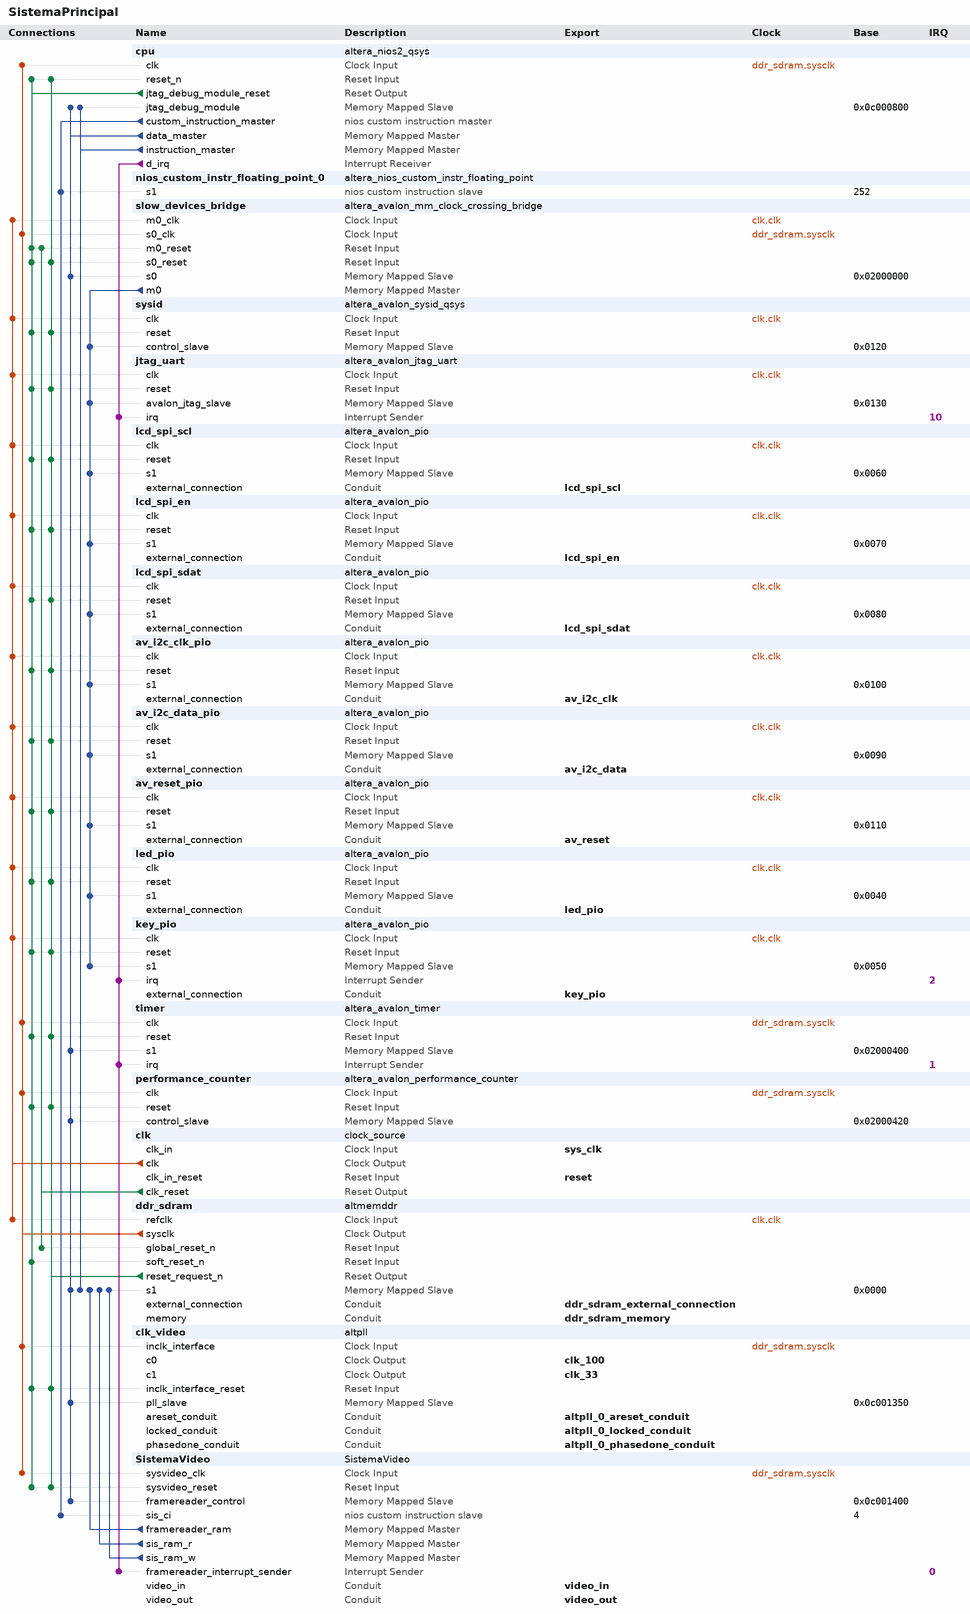
[diagram p0: system contents]
# Platform Designer (Qsys) system SistemaPrincipal, Cyclone III EP3C25F324C6
# Parameters at their usual value, and those the tool derives, are not listed.
package require -exact qsys 12.1
create_system SistemaPrincipal
set_project_property DEVICE_FAMILY {Cyclone III}
set_project_property DEVICE EP3C25F324C6

add_instance cpu altera_nios2_qsys 12.1
set_instance_parameter_value cpu manuallyAssignCpuID false
set_instance_parameter_value cpu resetSlave ddr_sdram.s1
set_instance_parameter_value cpu exceptionSlave ddr_sdram.s1
set_instance_parameter_value cpu breakSlave cpu.jtag_debug_module
set_instance_parameter_value cpu impl Fast
set_instance_parameter_value cpu icache_size 4096
set_instance_parameter_value cpu dcache_size 1024

add_instance nios_custom_instr_floating_point_0 altera_nios_custom_instr_floating_point 12.1
set_instance_parameter_value nios_custom_instr_floating_point_0 useDivider 0

add_instance slow_devices_bridge altera_avalon_mm_clock_crossing_bridge 12.1
set_instance_parameter_value slow_devices_bridge DATA_WIDTH 32
set_instance_parameter_value slow_devices_bridge ADDRESS_WIDTH 10
set_instance_parameter_value slow_devices_bridge MAX_BURST_SIZE 1
set_instance_parameter_value slow_devices_bridge COMMAND_FIFO_DEPTH 16
set_instance_parameter_value slow_devices_bridge RESPONSE_FIFO_DEPTH 64
set_instance_parameter_value slow_devices_bridge MASTER_SYNC_DEPTH 3
set_instance_parameter_value slow_devices_bridge SLAVE_SYNC_DEPTH 3

add_instance sysid altera_avalon_sysid_qsys 12.1
set_instance_parameter_value sysid id 0

add_instance jtag_uart altera_avalon_jtag_uart 12.1
set_instance_parameter_value jtag_uart readBufferDepth 32
set_instance_parameter_value jtag_uart readIRQThreshold 4
set_instance_parameter_value jtag_uart simInteractiveOptions NO_INTERACTIVE_WINDOWS
set_instance_parameter_value jtag_uart writeBufferDepth 32
set_instance_parameter_value jtag_uart writeIRQThreshold 4

add_instance lcd_spi_scl altera_avalon_pio 12.1
set_instance_parameter_value lcd_spi_scl direction Output
set_instance_parameter_value lcd_spi_scl width 1

add_instance lcd_spi_en altera_avalon_pio 12.1
set_instance_parameter_value lcd_spi_en direction Output
set_instance_parameter_value lcd_spi_en width 1

add_instance lcd_spi_sdat altera_avalon_pio 12.1
set_instance_parameter_value lcd_spi_sdat direction Bidir
set_instance_parameter_value lcd_spi_sdat simDoTestBenchWiring true
set_instance_parameter_value lcd_spi_sdat width 1

add_instance av_i2c_clk_pio altera_avalon_pio 12.1
set_instance_parameter_value av_i2c_clk_pio direction Output
set_instance_parameter_value av_i2c_clk_pio width 1

add_instance av_i2c_data_pio altera_avalon_pio 12.1
set_instance_parameter_value av_i2c_data_pio direction Bidir
set_instance_parameter_value av_i2c_data_pio simDoTestBenchWiring true
set_instance_parameter_value av_i2c_data_pio width 1

add_instance av_reset_pio altera_avalon_pio 12.1
set_instance_parameter_value av_reset_pio direction Output
set_instance_parameter_value av_reset_pio width 1

add_instance led_pio altera_avalon_pio 12.1
set_instance_parameter_value led_pio direction Output
set_instance_parameter_value led_pio width 8

add_instance key_pio altera_avalon_pio 12.1
set_instance_parameter_value key_pio captureEdge true
set_instance_parameter_value key_pio direction Input
set_instance_parameter_value key_pio generateIRQ true
set_instance_parameter_value key_pio irqType EDGE
set_instance_parameter_value key_pio width 8

add_instance timer altera_avalon_timer 12.1
set_instance_parameter_value timer period 10
set_instance_parameter_value timer periodUnits USEC
set_instance_parameter_value timer timerPreset FULL_FEATURED

add_instance performance_counter altera_avalon_performance_counter 12.1
set_instance_parameter_value performance_counter numberOfSections 1

add_instance clk clock_source 12.1
set_instance_parameter_value clk clockFrequency 50000000

add_instance ddr_sdram altmemddr 12.1
set_instance_parameter_value ddr_sdram pipeline_commands false
set_instance_parameter_value ddr_sdram debug_en false
set_instance_parameter_value ddr_sdram export_debug_port false
set_instance_parameter_value ddr_sdram use_generated_memory_model true
set_instance_parameter_value ddr_sdram dedicated_memory_clk_phase_label {Dedicated memory clock phase:}
set_instance_parameter_value ddr_sdram mem_if_clk_mhz 150.0
set_instance_parameter_value ddr_sdram quartus_project_exists false
set_instance_parameter_value ddr_sdram local_if_drate Full
set_instance_parameter_value ddr_sdram enable_v72_rsu false
set_instance_parameter_value ddr_sdram local_if_clk_mhz_label 150,0
set_instance_parameter_value ddr_sdram new_variant true
set_instance_parameter_value ddr_sdram mem_if_memtype {DDR SDRAM}
set_instance_parameter_value ddr_sdram pll_ref_clk_mhz 50.0
set_instance_parameter_value ddr_sdram mem_if_clk_ps_label {(6667 ps)}
set_instance_parameter_value ddr_sdram family {Cyclone III}
set_instance_parameter_value ddr_sdram project_family {Cyclone III}
set_instance_parameter_value ddr_sdram speed_grade 6
set_instance_parameter_value ddr_sdram dedicated_memory_clk_phase 0
set_instance_parameter_value ddr_sdram pll_ref_clk_ps_label {(20000 ps)}
set_instance_parameter_value ddr_sdram avalon_burst_length 1
set_instance_parameter_value ddr_sdram mem_if_clk_pair_count 1
set_instance_parameter_value ddr_sdram mem_if_cs_per_dimm 1
set_instance_parameter_value ddr_sdram pre_latency_label {Fix read latency at:}
set_instance_parameter_value ddr_sdram dedicated_memory_clk_en false
set_instance_parameter_value ddr_sdram mirror_addressing 0
set_instance_parameter_value ddr_sdram mem_if_bankaddr_width 2
set_instance_parameter_value ddr_sdram register_control_word_9 0000
set_instance_parameter_value ddr_sdram mem_if_rowaddr_width 13
set_instance_parameter_value ddr_sdram mem_dyn_deskew_en false
set_instance_parameter_value ddr_sdram post_latency_label {cycles (0 cycles=minimum latency, non-deterministic)}
set_instance_parameter_value ddr_sdram mem_if_dm_pins_en Yes
set_instance_parameter_value ddr_sdram local_if_dwidth_label 32
set_instance_parameter_value ddr_sdram register_control_word_7 0000
set_instance_parameter_value ddr_sdram register_control_word_8 0000
set_instance_parameter_value ddr_sdram mem_if_preset {Custom (PSC A2S56D40CTP-G5)}
set_instance_parameter_value ddr_sdram mem_if_pchaddr_bit 10
set_instance_parameter_value ddr_sdram WIDTH_RATIO 4
set_instance_parameter_value ddr_sdram vendor Other
set_instance_parameter_value ddr_sdram register_control_word_3 0000
set_instance_parameter_value ddr_sdram register_control_word_4 0000
set_instance_parameter_value ddr_sdram chip_or_dimm {Discrete Device}
set_instance_parameter_value ddr_sdram register_control_word_5 0000
set_instance_parameter_value ddr_sdram register_control_word_6 0000
set_instance_parameter_value ddr_sdram mem_fmax 200.0
set_instance_parameter_value ddr_sdram register_control_word_0 0000
set_instance_parameter_value ddr_sdram register_control_word_size 4
set_instance_parameter_value ddr_sdram register_control_word_1 0000
set_instance_parameter_value ddr_sdram register_control_word_2 0000
set_instance_parameter_value ddr_sdram register_control_word_11 0000
set_instance_parameter_value ddr_sdram register_control_word_10 0000
set_instance_parameter_value ddr_sdram mem_if_cs_width 1
set_instance_parameter_value ddr_sdram mem_if_preset_rlat 0
set_instance_parameter_value ddr_sdram mem_if_cs_per_rank 1
set_instance_parameter_value ddr_sdram fast_simulation_en FAST
set_instance_parameter_value ddr_sdram register_control_word_15 0000
set_instance_parameter_value ddr_sdram register_control_word_14 0000
set_instance_parameter_value ddr_sdram mem_if_dwidth 16
set_instance_parameter_value ddr_sdram mem_if_dq_per_dqs 8
set_instance_parameter_value ddr_sdram mem_if_coladdr_width 9
set_instance_parameter_value ddr_sdram register_control_word_13 0000
set_instance_parameter_value ddr_sdram register_control_word_12 0000
set_instance_parameter_value ddr_sdram mem_tiha_ps 600
set_instance_parameter_value ddr_sdram mem_tdsh_ck 0.2
set_instance_parameter_value ddr_sdram mem_if_trfc_ns 70.0
set_instance_parameter_value ddr_sdram mem_tqh_ck 0.36
set_instance_parameter_value ddr_sdram mem_tisa_ps 600
set_instance_parameter_value ddr_sdram mem_tdss_ck 0.2
set_instance_parameter_value ddr_sdram mem_trtp_ns 0.0
set_instance_parameter_value ddr_sdram mem_if_tinit_us 200.0
set_instance_parameter_value ddr_sdram mem_if_trcd_ns 15.0
set_instance_parameter_value ddr_sdram mem_if_twtr_ck 2
set_instance_parameter_value ddr_sdram mem_trrd_ns 11.0
set_instance_parameter_value ddr_sdram mem_tdqss_ck 0.28
set_instance_parameter_value ddr_sdram mem_tqhs_ps 500
set_instance_parameter_value ddr_sdram mem_tdsa_ps 400
set_instance_parameter_value ddr_sdram mem_tac_ps 700
set_instance_parameter_value ddr_sdram mem_tdha_ps 400
set_instance_parameter_value ddr_sdram mem_if_tras_ns 40.0
set_instance_parameter_value ddr_sdram mem_if_twr_ns 15.0
set_instance_parameter_value ddr_sdram mem_tdqsck_ps 550
set_instance_parameter_value ddr_sdram mem_if_trp_ns 15.0
set_instance_parameter_value ddr_sdram mem_tdqsq_ps 400
set_instance_parameter_value ddr_sdram mem_if_tmrd_ns 10.0
set_instance_parameter_value ddr_sdram mem_tfaw_ns 0.0
set_instance_parameter_value ddr_sdram mem_if_trefi_us 7.0
set_instance_parameter_value ddr_sdram mem_tcl_40_fmax 533.0
set_instance_parameter_value ddr_sdram mem_odt Disabled
set_instance_parameter_value ddr_sdram mp_WLH_percent 0.6
set_instance_parameter_value ddr_sdram mem_drv_str Normal
set_instance_parameter_value ddr_sdram mp_DH_percent 0.5
set_instance_parameter_value ddr_sdram input_period 0
set_instance_parameter_value ddr_sdram mp_QH_percent 0.5
set_instance_parameter_value ddr_sdram mp_QHS_percent 0.5
set_instance_parameter_value ddr_sdram mem_tcl_30_fmax 200.0
set_instance_parameter_value ddr_sdram ac_clk_select 90
set_instance_parameter_value ddr_sdram mp_DQSQ_percent 0.65
set_instance_parameter_value ddr_sdram mp_DS_percent 0.6
set_instance_parameter_value ddr_sdram pll_reconfig_ports_en false
set_instance_parameter_value ddr_sdram mem_btype Sequential
set_instance_parameter_value ddr_sdram mp_IS_percent 0.7
set_instance_parameter_value ddr_sdram mem_tcl 3.0
set_instance_parameter_value ddr_sdram mp_DQSS_percent 0.5
set_instance_parameter_value ddr_sdram export_bank_info false
set_instance_parameter_value ddr_sdram mp_DSS_percent 0.6
set_instance_parameter_value ddr_sdram mem_dll_en Yes
set_instance_parameter_value ddr_sdram ac_phase 90
set_instance_parameter_value ddr_sdram mem_if_oct_en false
set_instance_parameter_value ddr_sdram mem_tcl_60_fmax 533.0
set_instance_parameter_value ddr_sdram mp_DSH_percent 0.6
set_instance_parameter_value ddr_sdram mem_if_dqsn_en false
set_instance_parameter_value ddr_sdram enable_mp_calibration true
set_instance_parameter_value ddr_sdram mp_IH_percent 0.6
set_instance_parameter_value ddr_sdram mem_tcl_15_fmax 533.0
set_instance_parameter_value ddr_sdram dll_external false
set_instance_parameter_value ddr_sdram mem_bl 4
set_instance_parameter_value ddr_sdram mp_WLS_percent 0.7
set_instance_parameter_value ddr_sdram mem_tcl_50_fmax 533.0
set_instance_parameter_value ddr_sdram mp_DQSCK_percent 0.5
set_instance_parameter_value ddr_sdram mem_tcl_25_fmax 200.0
set_instance_parameter_value ddr_sdram mem_tcl_20_fmax 133.333
set_instance_parameter_value ddr_sdram cfg_reorder_data false
set_instance_parameter_value ddr_sdram ctl_ecc_en false
set_instance_parameter_value ddr_sdram ctl_hrb_en false
set_instance_parameter_value ddr_sdram ref_clk_source clk
set_instance_parameter_value ddr_sdram cfg_data_reordering_type INTER_BANK
set_instance_parameter_value ddr_sdram ctl_powerdn_en false
set_instance_parameter_value ddr_sdram multicast_wr_en false
set_instance_parameter_value ddr_sdram auto_powerdn_cycles 0
set_instance_parameter_value ddr_sdram ctl_self_refresh_en false
set_instance_parameter_value ddr_sdram cfg_starve_limit 10
set_instance_parameter_value ddr_sdram ctl_latency 0
set_instance_parameter_value ddr_sdram tool_context SOPC_BUILDER
set_instance_parameter_value ddr_sdram mem_addr_mapping CHIP_ROW_BANK_COL
set_instance_parameter_value ddr_sdram burst_merge_en false
set_instance_parameter_value ddr_sdram user_refresh_en false
set_instance_parameter_value ddr_sdram qsys_mode true
set_instance_parameter_value ddr_sdram clk_source_sharing_en false
set_instance_parameter_value ddr_sdram ctl_lookahead_depth 4
set_instance_parameter_value ddr_sdram ctl_autopch_en false
set_instance_parameter_value ddr_sdram ctl_dynamic_bank_allocation false
set_instance_parameter_value ddr_sdram ctl_dynamic_bank_num 4
set_instance_parameter_value ddr_sdram local_if_type_avalon true
set_instance_parameter_value ddr_sdram csr_en false
set_instance_parameter_value ddr_sdram ctl_auto_correct_en false
set_instance_parameter_value ddr_sdram auto_powerdn_en false
set_instance_parameter_value ddr_sdram phy_if_type_afi true
set_instance_parameter_value ddr_sdram controller_type ngv110_ctl
set_instance_parameter_value ddr_sdram max_local_size 4
set_instance_parameter_value ddr_sdram mem_srtr Normal
set_instance_parameter_value ddr_sdram mem_mpr_loc {Predefined Pattern}
set_instance_parameter_value ddr_sdram dss_tinit_rst_us 200.0
set_instance_parameter_value ddr_sdram mem_tcl_90_fmax 400.0
set_instance_parameter_value ddr_sdram mem_rtt_wr {Dynamic ODT off}
set_instance_parameter_value ddr_sdram mem_tcl_100_fmax 400.0
set_instance_parameter_value ddr_sdram mem_pasr {Full Array}
set_instance_parameter_value ddr_sdram mem_asrm {Manual SR Reference (SRT)}
set_instance_parameter_value ddr_sdram mem_mpr_oper {Predefined Pattern}
set_instance_parameter_value ddr_sdram mem_tcl_80_fmax 400.0
set_instance_parameter_value ddr_sdram mem_drv_impedance RZQ/7
set_instance_parameter_value ddr_sdram mem_rtt_nom {ODT Disabled}
set_instance_parameter_value ddr_sdram mem_tcl_70_fmax 400.0
set_instance_parameter_value ddr_sdram mem_wtcl 5.0
set_instance_parameter_value ddr_sdram mem_dll_pch {Fast Exit}
set_instance_parameter_value ddr_sdram mem_atcl Disabled
set_instance_parameter_value ddr_sdram board_settings_valid true
set_instance_parameter_value ddr_sdram t_IH 0.6
set_instance_parameter_value ddr_sdram board_intra_DQS_group_skew 0.02
set_instance_parameter_value ddr_sdram isi_DQS 0.0
set_instance_parameter_value ddr_sdram addr_cmd_slew_rate 1.0
set_instance_parameter_value ddr_sdram board_tpd_inter_DIMM 0.05
set_instance_parameter_value ddr_sdram board_addresscmd_CK_skew 0.0
set_instance_parameter_value ddr_sdram t_DS_calculated 0,400
set_instance_parameter_value ddr_sdram isi_addresscmd_hold 0.0
set_instance_parameter_value ddr_sdram t_IS 0.6
set_instance_parameter_value ddr_sdram restore_default_toggle false
set_instance_parameter_value ddr_sdram dqs_dqsn_slew_rate 2.0
set_instance_parameter_value ddr_sdram dq_slew_rate 1.0
set_instance_parameter_value ddr_sdram board_inter_DQS_group_skew 0.02
set_instance_parameter_value ddr_sdram isi_addresscmd_setup 0.0
set_instance_parameter_value ddr_sdram board_minCK_DQS_skew -0.01
set_instance_parameter_value ddr_sdram t_IS_calculated 0,600
set_instance_parameter_value ddr_sdram num_slots_or_devices 1
set_instance_parameter_value ddr_sdram board_maxCK_DQS_skew 0.01
set_instance_parameter_value ddr_sdram board_skew_ps 20
set_instance_parameter_value ddr_sdram t_DH 0.4
set_instance_parameter_value ddr_sdram ck_ckn_slew_rate 2.0
set_instance_parameter_value ddr_sdram isi_DQ 0.0
set_instance_parameter_value ddr_sdram t_IH_calculated 0,600
set_instance_parameter_value ddr_sdram t_DH_calculated 0,400
set_instance_parameter_value ddr_sdram t_DS 0.4

add_instance clk_video altpll 12.1
set_instance_parameter_value clk_video INCLK0_INPUT_FREQUENCY 6666
set_instance_parameter_value clk_video OPERATION_MODE NO_COMPENSATION
set_instance_parameter_value clk_video CLK0_MULTIPLY_BY 2
set_instance_parameter_value clk_video CLK1_MULTIPLY_BY 2
set_instance_parameter_value clk_video CLK0_DIVIDE_BY 3
set_instance_parameter_value clk_video CLK1_DIVIDE_BY 9
set_instance_parameter_value clk_video CLK1_PHASE_SHIFT 0
set_instance_parameter_value clk_video CLK1_DUTY_CYCLE 50
set_instance_parameter_value clk_video PORT_clk1 PORT_USED
set_instance_parameter_value clk_video PORT_clk2 PORT_UNUSED
set_instance_parameter_value clk_video PORT_clk3 PORT_UNUSED
set_instance_parameter_value clk_video PORT_ARESET PORT_USED
set_instance_parameter_value clk_video PORT_LOCKED PORT_USED

add_instance SistemaVideo SistemaVideo 1.0

# connections
add_connection clk.clk av_i2c_clk_pio.clk clock
add_connection clk.clk av_i2c_data_pio.clk clock
add_connection clk.clk av_reset_pio.clk clock
add_connection clk.clk ddr_sdram.refclk clock
add_connection clk.clk jtag_uart.clk clock
add_connection clk.clk key_pio.clk clock
add_connection clk.clk lcd_spi_en.clk clock
add_connection clk.clk lcd_spi_scl.clk clock
add_connection clk.clk lcd_spi_sdat.clk clock
add_connection clk.clk led_pio.clk clock
add_connection clk.clk slow_devices_bridge.m0_clk clock
add_connection clk.clk sysid.clk clock
add_connection ddr_sdram.sysclk clk_video.inclk_interface clock
add_connection ddr_sdram.sysclk cpu.clk clock
add_connection ddr_sdram.sysclk performance_counter.clk clock
add_connection ddr_sdram.sysclk SistemaVideo.sysvideo_clk clock
add_connection ddr_sdram.sysclk slow_devices_bridge.s0_clk clock
add_connection ddr_sdram.sysclk timer.clk clock
add_connection clk.clk_reset ddr_sdram.global_reset_n reset
add_connection clk.clk_reset slow_devices_bridge.m0_reset reset
add_connection cpu.jtag_debug_module_reset av_i2c_clk_pio.reset reset
add_connection cpu.jtag_debug_module_reset av_i2c_data_pio.reset reset
add_connection cpu.jtag_debug_module_reset av_reset_pio.reset reset
add_connection cpu.jtag_debug_module_reset clk_video.inclk_interface_reset reset
add_connection cpu.jtag_debug_module_reset cpu.reset_n reset
add_connection cpu.jtag_debug_module_reset ddr_sdram.soft_reset_n reset
add_connection cpu.jtag_debug_module_reset jtag_uart.reset reset
add_connection cpu.jtag_debug_module_reset key_pio.reset reset
add_connection cpu.jtag_debug_module_reset lcd_spi_en.reset reset
add_connection cpu.jtag_debug_module_reset lcd_spi_scl.reset reset
add_connection cpu.jtag_debug_module_reset lcd_spi_sdat.reset reset
add_connection cpu.jtag_debug_module_reset led_pio.reset reset
add_connection cpu.jtag_debug_module_reset performance_counter.reset reset
add_connection cpu.jtag_debug_module_reset SistemaVideo.sysvideo_reset reset
add_connection cpu.jtag_debug_module_reset slow_devices_bridge.m0_reset reset
add_connection cpu.jtag_debug_module_reset slow_devices_bridge.s0_reset reset
add_connection cpu.jtag_debug_module_reset sysid.reset reset
add_connection cpu.jtag_debug_module_reset timer.reset reset
add_connection ddr_sdram.reset_request_n av_i2c_clk_pio.reset reset
add_connection ddr_sdram.reset_request_n av_i2c_data_pio.reset reset
add_connection ddr_sdram.reset_request_n av_reset_pio.reset reset
add_connection ddr_sdram.reset_request_n clk_video.inclk_interface_reset reset
add_connection ddr_sdram.reset_request_n cpu.reset_n reset
add_connection ddr_sdram.reset_request_n jtag_uart.reset reset
add_connection ddr_sdram.reset_request_n key_pio.reset reset
add_connection ddr_sdram.reset_request_n lcd_spi_en.reset reset
add_connection ddr_sdram.reset_request_n lcd_spi_scl.reset reset
add_connection ddr_sdram.reset_request_n lcd_spi_sdat.reset reset
add_connection ddr_sdram.reset_request_n led_pio.reset reset
add_connection ddr_sdram.reset_request_n performance_counter.reset reset
add_connection ddr_sdram.reset_request_n SistemaVideo.sysvideo_reset reset
add_connection ddr_sdram.reset_request_n slow_devices_bridge.s0_reset reset
add_connection ddr_sdram.reset_request_n sysid.reset reset
add_connection ddr_sdram.reset_request_n timer.reset reset
add_connection cpu.data_master clk_video.pll_slave avalon
set_connection_parameter_value cpu.data_master/clk_video.pll_slave baseAddress 0x0c001350
add_connection cpu.data_master cpu.jtag_debug_module avalon
set_connection_parameter_value cpu.data_master/cpu.jtag_debug_module baseAddress 0x0c000800
add_connection cpu.data_master ddr_sdram.s1 avalon
set_connection_parameter_value cpu.data_master/ddr_sdram.s1 baseAddress 0x0000
add_connection cpu.data_master performance_counter.control_slave avalon
set_connection_parameter_value cpu.data_master/performance_counter.control_slave baseAddress 0x02000420
add_connection cpu.data_master SistemaVideo.framereader_control avalon
set_connection_parameter_value cpu.data_master/SistemaVideo.framereader_control baseAddress 0x0c001400
add_connection cpu.data_master slow_devices_bridge.s0 avalon
set_connection_parameter_value cpu.data_master/slow_devices_bridge.s0 baseAddress 0x02000000
add_connection cpu.data_master timer.s1 avalon
set_connection_parameter_value cpu.data_master/timer.s1 baseAddress 0x02000400
add_connection cpu.instruction_master cpu.jtag_debug_module avalon
set_connection_parameter_value cpu.instruction_master/cpu.jtag_debug_module baseAddress 0x0c000800
add_connection cpu.instruction_master ddr_sdram.s1 avalon
set_connection_parameter_value cpu.instruction_master/ddr_sdram.s1 baseAddress 0x0000
add_connection SistemaVideo.framereader_ram ddr_sdram.s1 avalon
set_connection_parameter_value SistemaVideo.framereader_ram/ddr_sdram.s1 baseAddress 0x0000
add_connection SistemaVideo.sis_ram_r ddr_sdram.s1 avalon
set_connection_parameter_value SistemaVideo.sis_ram_r/ddr_sdram.s1 baseAddress 0x0000
add_connection SistemaVideo.sis_ram_w ddr_sdram.s1 avalon
set_connection_parameter_value SistemaVideo.sis_ram_w/ddr_sdram.s1 baseAddress 0x0000
add_connection slow_devices_bridge.m0 av_i2c_clk_pio.s1 avalon
set_connection_parameter_value slow_devices_bridge.m0/av_i2c_clk_pio.s1 baseAddress 0x0100
add_connection slow_devices_bridge.m0 av_i2c_data_pio.s1 avalon
set_connection_parameter_value slow_devices_bridge.m0/av_i2c_data_pio.s1 baseAddress 0x0090
add_connection slow_devices_bridge.m0 av_reset_pio.s1 avalon
set_connection_parameter_value slow_devices_bridge.m0/av_reset_pio.s1 baseAddress 0x0110
add_connection slow_devices_bridge.m0 jtag_uart.avalon_jtag_slave avalon
set_connection_parameter_value slow_devices_bridge.m0/jtag_uart.avalon_jtag_slave baseAddress 0x0130
add_connection slow_devices_bridge.m0 key_pio.s1 avalon
set_connection_parameter_value slow_devices_bridge.m0/key_pio.s1 baseAddress 0x0050
add_connection slow_devices_bridge.m0 lcd_spi_en.s1 avalon
set_connection_parameter_value slow_devices_bridge.m0/lcd_spi_en.s1 baseAddress 0x0070
add_connection slow_devices_bridge.m0 lcd_spi_scl.s1 avalon
set_connection_parameter_value slow_devices_bridge.m0/lcd_spi_scl.s1 baseAddress 0x0060
add_connection slow_devices_bridge.m0 lcd_spi_sdat.s1 avalon
set_connection_parameter_value slow_devices_bridge.m0/lcd_spi_sdat.s1 baseAddress 0x0080
add_connection slow_devices_bridge.m0 led_pio.s1 avalon
set_connection_parameter_value slow_devices_bridge.m0/led_pio.s1 baseAddress 0x0040
add_connection slow_devices_bridge.m0 sysid.control_slave avalon
set_connection_parameter_value slow_devices_bridge.m0/sysid.control_slave baseAddress 0x0120
add_connection cpu.d_irq jtag_uart.irq interrupt
set_connection_parameter_value cpu.d_irq/jtag_uart.irq irqNumber 10
add_connection cpu.d_irq key_pio.irq interrupt
set_connection_parameter_value cpu.d_irq/key_pio.irq irqNumber 2
add_connection cpu.d_irq SistemaVideo.framereader_interrupt_sender interrupt
set_connection_parameter_value cpu.d_irq/SistemaVideo.framereader_interrupt_sender irqNumber 0
add_connection cpu.d_irq timer.irq interrupt
set_connection_parameter_value cpu.d_irq/timer.irq irqNumber 1
add_connection cpu.custom_instruction_master nios_custom_instr_floating_point_0.s1 nios_custom_instruction
set_connection_parameter_value cpu.custom_instruction_master/nios_custom_instr_floating_point_0.s1 CIName nios_custom_instr_floating_point_0
set_connection_parameter_value cpu.custom_instruction_master/nios_custom_instr_floating_point_0.s1 baseAddress 252
add_connection cpu.custom_instruction_master SistemaVideo.sis_ci nios_custom_instruction
set_connection_parameter_value cpu.custom_instruction_master/SistemaVideo.sis_ci CIName sobel_instruction_set
set_connection_parameter_value cpu.custom_instruction_master/SistemaVideo.sis_ci baseAddress 4

# exported interfaces
add_interface lcd_spi_en conduit end
set_interface_property lcd_spi_en EXPORT_OF lcd_spi_en.external_connection
add_interface lcd_spi_sdat conduit end
set_interface_property lcd_spi_sdat EXPORT_OF lcd_spi_sdat.external_connection
add_interface av_i2c_data conduit end
set_interface_property av_i2c_data EXPORT_OF av_i2c_data_pio.external_connection
add_interface av_reset conduit end
set_interface_property av_reset EXPORT_OF av_reset_pio.external_connection
add_interface lcd_spi_scl conduit end
set_interface_property lcd_spi_scl EXPORT_OF lcd_spi_scl.external_connection
add_interface av_i2c_clk conduit end
set_interface_property av_i2c_clk EXPORT_OF av_i2c_clk_pio.external_connection
add_interface sys_clk clock sink
set_interface_property sys_clk EXPORT_OF clk.clk_in
add_interface ddr_sdram_memory conduit end
set_interface_property ddr_sdram_memory EXPORT_OF ddr_sdram.memory
add_interface altpll_0_phasedone_conduit conduit end
set_interface_property altpll_0_phasedone_conduit EXPORT_OF clk_video.phasedone_conduit
add_interface altpll_0_locked_conduit conduit end
set_interface_property altpll_0_locked_conduit EXPORT_OF clk_video.locked_conduit
add_interface altpll_0_areset_conduit conduit end
set_interface_property altpll_0_areset_conduit EXPORT_OF clk_video.areset_conduit
add_interface clk_33 clock source
set_interface_property clk_33 EXPORT_OF clk_video.c1
add_interface clk_100 clock source
set_interface_property clk_100 EXPORT_OF clk_video.c0
add_interface ddr_sdram_external_connection conduit end
set_interface_property ddr_sdram_external_connection EXPORT_OF ddr_sdram.external_connection
add_interface video_out conduit end
set_interface_property video_out EXPORT_OF SistemaVideo.video_out
add_interface video_in conduit end
set_interface_property video_in EXPORT_OF SistemaVideo.video_in
add_interface reset reset sink
set_interface_property reset EXPORT_OF clk.clk_in_reset
add_interface led_pio conduit end
set_interface_property led_pio EXPORT_OF led_pio.external_connection
add_interface key_pio conduit end
set_interface_property key_pio EXPORT_OF key_pio.external_connection

save_system SistemaPrincipal.qsys
